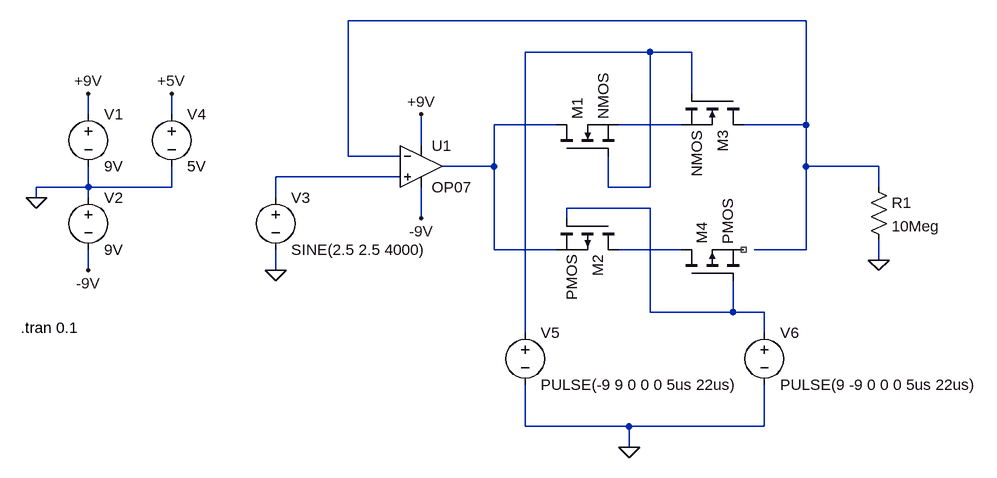
[diagram p0: schematic r3_dbl_tgate.asc]
r3_dbl_tgate.asc, the LTspice schematic file:
Version 4
SHEET 1 1252 680
WIRE 816 -160 112 -160
WIRE 576 -112 384 -112
WIRE 640 -112 576 -112
WIRE 640 -48 640 -112
WIRE -288 -16 -288 -48
WIRE -160 -16 -160 -48
WIRE 432 0 336 0
WIRE 624 0 528 0
WIRE 816 0 816 -160
WIRE 816 0 720 0
WIRE 224 32 224 -16
WIRE 112 48 112 -160
WIRE 192 48 112 48
WIRE 336 64 336 0
WIRE 336 64 256 64
WIRE 816 64 816 0
WIRE 928 64 816 64
WIRE 192 80 0 80
WIRE -288 96 -288 64
WIRE -288 96 -368 96
WIRE -160 96 -160 64
WIRE -160 96 -288 96
WIRE 512 96 512 48
WIRE 576 96 576 -112
WIRE 576 96 512 96
WIRE 928 96 928 64
WIRE -368 112 -368 96
WIRE -288 112 -288 96
WIRE 0 112 0 80
WIRE 576 128 448 128
WIRE 224 144 224 96
WIRE 448 144 448 128
WIRE 336 192 336 64
WIRE 432 192 336 192
WIRE 624 192 528 192
WIRE 816 192 816 64
WIRE 816 192 736 192
WIRE 928 208 928 176
WIRE -288 224 -288 192
WIRE 0 224 0 192
WIRE 576 288 576 128
WIRE 704 288 704 240
WIRE 704 288 576 288
WIRE 752 288 704 288
WIRE 384 320 384 -112
WIRE 752 320 752 288
WIRE 384 464 384 400
WIRE 544 464 384 464
WIRE 752 464 752 400
WIRE 752 464 544 464
WIRE 544 496 544 464
FLAG -368 112 0
FLAG -288 -48 +9V
FLAG -288 224 -9V
FLAG 0 224 0
FLAG -160 -48 +5V
FLAG 224 -16 +9V
FLAG 224 144 -9V
FLAG 544 496 0
FLAG 928 208 0
SYMBOL voltage -288 -32 R0
WINDOW 123 0 0 Left 0
WINDOW 39 0 0 Left 0
SYMATTR InstName V1
SYMATTR Value 9V
SYMBOL voltage -288 96 R0
WINDOW 123 0 0 Left 0
WINDOW 39 0 0 Left 0
SYMATTR InstName V2
SYMATTR Value 9V
SYMBOL voltage -160 -32 R0
WINDOW 123 0 0 Left 0
WINDOW 39 0 0 Left 0
SYMATTR InstName V4
SYMATTR Value 5V
SYMBOL Opamps\\OP07 224 0 R0
SYMATTR InstName U1
SYMBOL voltage 0 96 R0
WINDOW 123 0 0 Left 0
WINDOW 39 0 0 Left 0
SYMATTR InstName V3
SYMATTR Value SINE(2.5 2.5 4000)
SYMBOL voltage 384 304 R0
WINDOW 123 0 0 Left 0
WINDOW 39 0 0 Left 0
SYMATTR InstName V5
SYMATTR Value PULSE(-9 9 0 0 0 5us 22us)
SYMBOL voltage 752 304 R0
WINDOW 123 0 0 Left 0
WINDOW 39 0 0 Left 0
SYMATTR InstName V6
SYMATTR Value PULSE(9 -9 0 0 0 5us 22us)
SYMBOL nmos 432 48 R270
SYMATTR InstName M1
SYMBOL pmos 528 144 R90
SYMATTR InstName M2
SYMBOL nmos 720 -48 R90
SYMATTR InstName M3
SYMBOL pmos 624 240 R270
SYMATTR InstName M4
SYMBOL res 912 80 R0
SYMATTR InstName R1
SYMATTR Value 10Meg
TEXT -392 312 Left 2 !.tran 0.1

The netlist it stands for:
* r3_dbl_tgate.asc
V1 +9V 0 9V
V2 0 -9V 9V
V4 +5V 0 5V
XU1 N005 N001 +9V -9V N003 LT1001  ; OP07, pins In+ In- V+ V- OUT
V3 N005 0 SINE(2.5 2.5 4000)
V5 N002 0 PULSE(-9 9 0 0 0 5us 22us)
V6 N006 0 PULSE(9 -9 0 0 0 5us 22us)
M1 N003 N002 N004 N004 NMOS
M2 N007 N006 N003 N003 PMOS
M3 N001 N002 N004 N004 NMOS
M4 N007 N006 NC_01 NC_01 PMOS
R1 N001 0 10Meg
.model NMOS NMOS
.model PMOS PMOS
.lib standard.mos
.tran 0.1
.lib LTC.lib
.backanno
.end